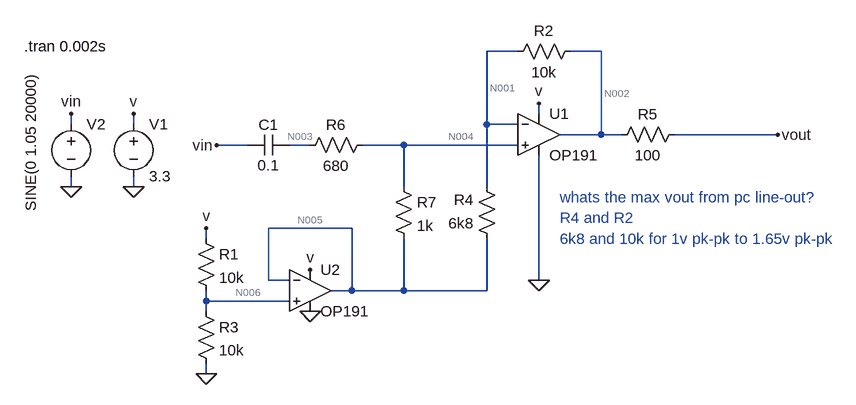
[diagram p0: schematic XY-AFE.asc]
XY-AFE.asc, the LTspice schematic file:
Version 4
SHEET 1 1044 680
WIRE 448 80 400 80
WIRE 576 80 528 80
WIRE 480 176 480 160
WIRE -240 192 -240 176
WIRE -144 192 -144 176
WIRE 400 192 400 80
WIRE 448 192 400 192
WIRE 576 208 576 80
WIRE 576 208 512 208
WIRE 608 208 576 208
WIRE 848 208 688 208
WIRE 32 224 -16 224
WIRE 128 224 96 224
WIRE 272 224 208 224
WIRE 448 224 272 224
WIRE -240 288 -240 272
WIRE -144 288 -144 272
WIRE 272 288 272 224
WIRE 400 288 400 192
WIRE 192 352 64 352
WIRE -32 368 -32 352
WIRE 64 432 64 352
WIRE 96 432 64 432
WIRE 480 432 480 240
WIRE 192 448 192 352
WIRE 192 448 160 448
WIRE 272 448 272 368
WIRE 272 448 192 448
WIRE 400 448 400 368
WIRE 400 448 272 448
WIRE -32 464 -32 448
WIRE 96 464 -32 464
WIRE -32 480 -32 464
WIRE -32 576 -32 560
FLAG 480 432 0
FLAG -144 288 0
FLAG -144 176 v
FLAG 480 160 v
FLAG 848 208 vout
FLAG -240 288 0
FLAG -240 176 vin
FLAG -16 224 vin
FLAG -32 576 0
FLAG -32 352 v
FLAG 128 480 0
FLAG 128 416 v
DATAFLAG 768 208 ""
DATAFLAG 352 448 ""
DATAFLAG 288 224 ""
SYMBOL OpAmps\\OP191 480 144 R0
SYMATTR InstName U1
SYMBOL voltage -144 176 R0
WINDOW 123 0 0 Left 0
WINDOW 39 0 0 Left 0
SYMATTR InstName V1
SYMATTR Value 3.3
SYMBOL res 544 64 R90
WINDOW 0 0 56 VBottom 2
WINDOW 3 32 56 VTop 2
SYMATTR InstName R2
SYMATTR Value 10k
SYMBOL res 416 384 R180
WINDOW 0 36 76 Left 2
WINDOW 3 36 40 Left 2
SYMATTR InstName R4
SYMATTR Value 6k8
SYMBOL res 704 192 R90
WINDOW 0 0 56 VBottom 2
WINDOW 3 32 56 VTop 2
SYMATTR InstName R5
SYMATTR Value 100
SYMBOL voltage -240 176 R0
WINDOW 3 -62 -63 VRight 2
WINDOW 123 0 0 Left 0
WINDOW 39 0 0 Left 0
SYMATTR Value SINE(0 1.05 20000)
SYMATTR InstName V2
SYMBOL res -48 352 R0
SYMATTR InstName R1
SYMATTR Value 10k
SYMBOL res -48 464 R0
SYMATTR InstName R3
SYMATTR Value 10k
SYMBOL res 224 208 R90
WINDOW 0 0 56 VBottom 2
WINDOW 3 32 56 VTop 2
SYMATTR InstName R6
SYMATTR Value 680
SYMBOL OpAmps\\OP191 128 384 R0
SYMATTR InstName U2
SYMBOL res 256 272 R0
SYMATTR InstName R7
SYMATTR Value 1k
SYMBOL cap 96 208 R90
WINDOW 0 0 32 VBottom 2
WINDOW 3 63 32 VBottom 2
SYMATTR InstName C1
SYMATTR Value 0.1
TEXT -312 72 Left 2 !.tran 0.002s
TEXT 512 368 Left 2 ;6k8 and 10k for 1v pk-pk to 1.65v pk-pk
TEXT 512 336 Left 2 ;R4 and R2
TEXT 512 304 Left 2 ;whats the max vout from pc line-out?

The netlist it stands for:
* XY-AFE.asc
XU1 N004 N001 v 0 N002 OP191  ; pins In+ In- V+ V- OUT
V1 v 0 3.3
R2 N002 N001 10k
R4 N005 N001 6k8
R5 vout N002 100
V2 vin 0 SINE(0 1.05 20000)
R1 v N006 10k
R3 N006 0 10k
R6 N004 N003 680
XU2 N006 N005 v 0 N005 OP191  ; pins In+ In- V+ V- OUT
R7 N004 N005 1k
C1 N003 vin 0.1
.tran 0.002s
* 6k8 and 10k for 1v pk-pk to 1.65v pk-pk
* R4 and R2
* whats the max vout from pc line-out?
.lib ADI.lib
.backanno
.end

* Results of the author's LTspice run, read from the files saved beside the schematic
* Operating Point, zero values left out:
*   V(v) = 3.3 V
*   V(n001) = 1.65 V
*   V(n004) = 1.65 V
*   V(n002) = 1.65 V
*   V(n005) = 1.65 V
*   V(vout) = 1.65 V
*   V(n006) = 1.65 V
*   V(n003) = 1.65 V
*   I(R2) = -37.48 nA
*   I(R4) = 7.433 nA
*   I(R1) = 165 µA
*   I(R3) = 165 µA
*   I(R7) = 29.95 nA
*   I(V1) = -624.6 µA
*   Ix(u1:1) = -29.95 nA
*   Ix(u1:2) = -30.05 nA
*   Ix(u1:99) = 229.8 µA
*   Ix(u1:50) = -229.8 µA
*   Ix(u1:45) = 37.48 nA
*   Ix(u2:1) = -29.95 nA
*   Ix(u2:2) = -30.05 nA
*   Ix(u2:99) = 229.8 µA
*   Ix(u2:50) = -229.8 µA
*   Ix(u2:45) = 52.57 nA
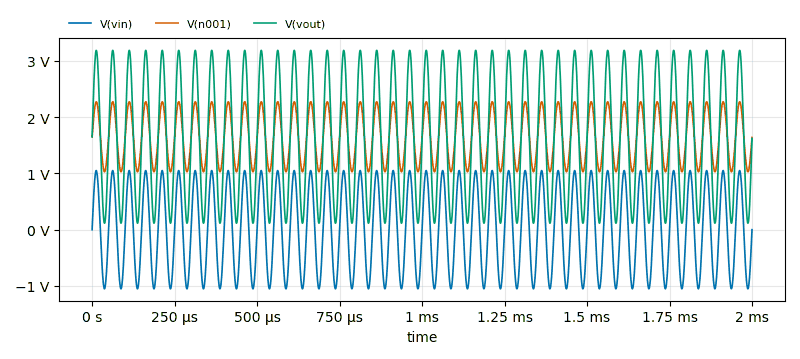
[diagram p1: Transient Analysis of XY-AFE.asc, plotted from the saved traces]
* Transient Analysis, 1 run:
*   V(vin): min -1.05 V, max 1.05 V, average 250.2 µV, rms 743.4 mV, last 0 V
*   V(n001): min 1.029 V, max 2.271 V, average 1.651 V, rms 1.708 V, last 1.638 V
*   V(vout): min 115.2 mV, max 3.185 V, average 1.651 V, rms 1.976 V, last 1.618 V